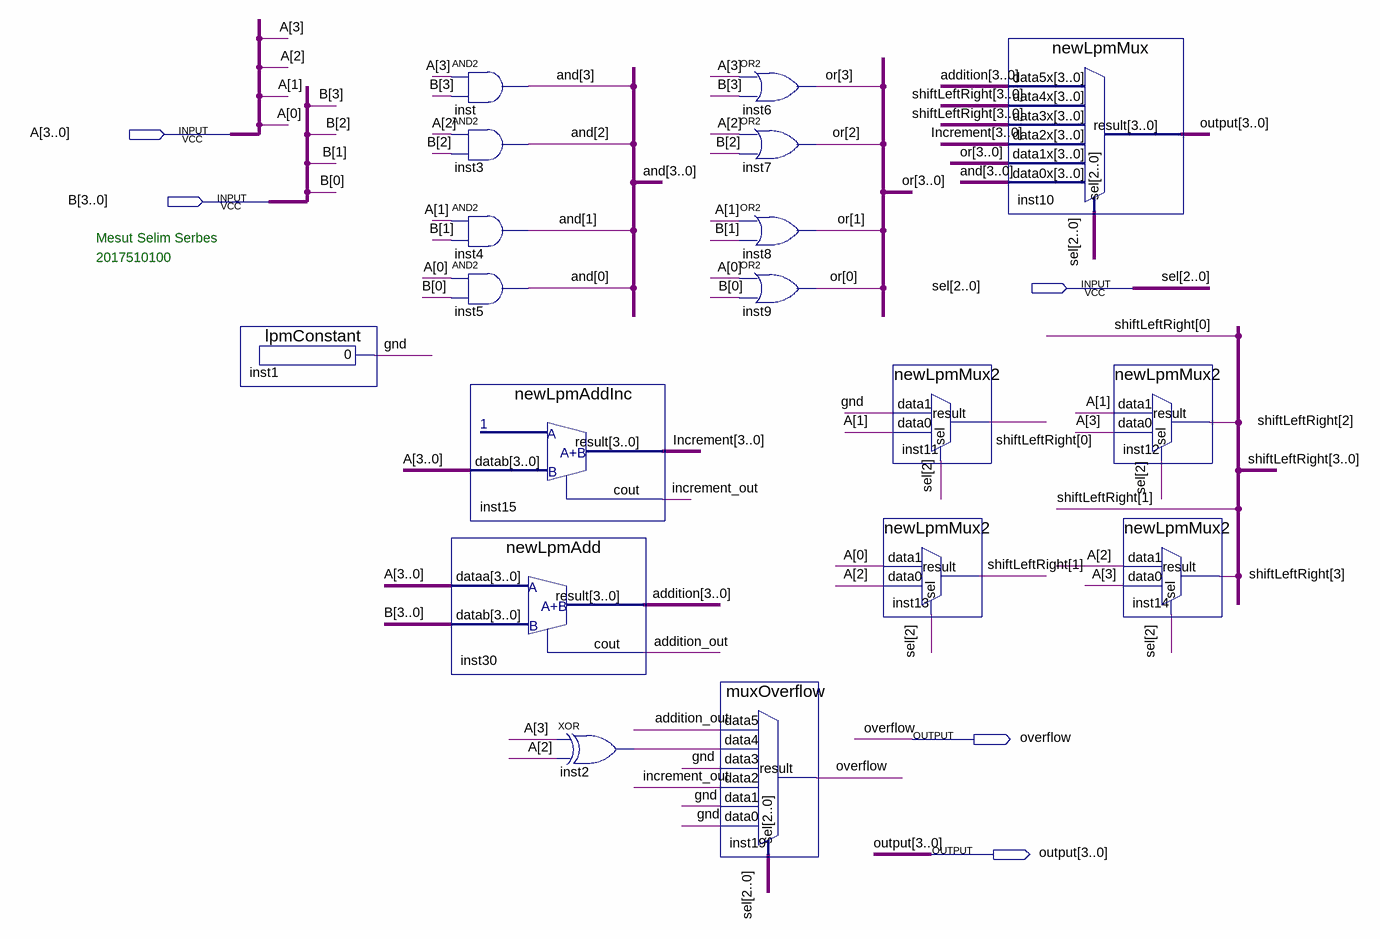
[diagram p0: schematic sheet]
// Quartus schematic ALU_Mesut_Selim_Serbes_2017510100.bdf as structural Verilog: 18 symbols, 5 pins
module ALU_Mesut_Selim_Serbes_2017510100 (
  input  [3:0] A,
  input  [3:0] B,
  input  [2:0] sel,
  output overflow,
  output [3:0] \output 
);

  wire addition_out, gnd, increment_out, inst2_out;
  wire [3:0] addition, \and , Increment, \or , shiftLeftRight;

  lpmConstant inst1 (.result(gnd));
  and inst (\and [3], A[3], B[3]);
  and inst3 (\and [2], A[2], B[2]);
  and inst4 (\and [1], A[1], B[1]);
  and inst5 (\and [0], A[0], B[0]);
  newLpmAddInc inst15 (.datab(A), .result(Increment), .cout(increment_out));
  newLpmAdd inst30 (.dataa(A), .datab(B), .result(addition), .cout(addition_out));
  xor inst2 (inst2_out, A[3], A[2]);
  muxOverflow inst19 (
    .data5(addition_out), .data4(inst2_out), .data3(gnd), .data2(increment_out), .data1(gnd), .data0(gnd),
    .sel(sel), .result(overflow));
  or inst6 (\or [3], A[3], B[3]);
  or inst7 (\or [2], A[2], B[2]);
  or inst8 (\or [1], A[1], B[1]);
  or inst9 (\or [0], A[0], B[0]);
  newLpmMux2 inst11 (.data1(gnd), .data0(A[1]), .sel(sel[2]), .result(shiftLeftRight[0]));
  newLpmMux2 inst13 (.data1(A[0]), .data0(A[2]), .sel(sel[2]), .result(shiftLeftRight[1]));
  newLpmMux inst10 (
    .data5x(addition), .data4x(shiftLeftRight), .data3x(shiftLeftRight), .data2x(Increment), .data1x(\or ),
    .data0x(\and ), .sel(sel), .result(\output ));
  newLpmMux2 inst12 (.data1(A[1]), .data0(A[3]), .sel(sel[2]), .result(shiftLeftRight[2]));
  newLpmMux2 inst14 (.data1(A[2]), .data0(A[3]), .sel(sel[2]), .result(shiftLeftRight[3]));

  // Notes on the sheet:
  //   Mesut Selim Serbes
  //   2017510100
endmodule
